# Altium schematic sheet Sheet1.SchDoc
size A
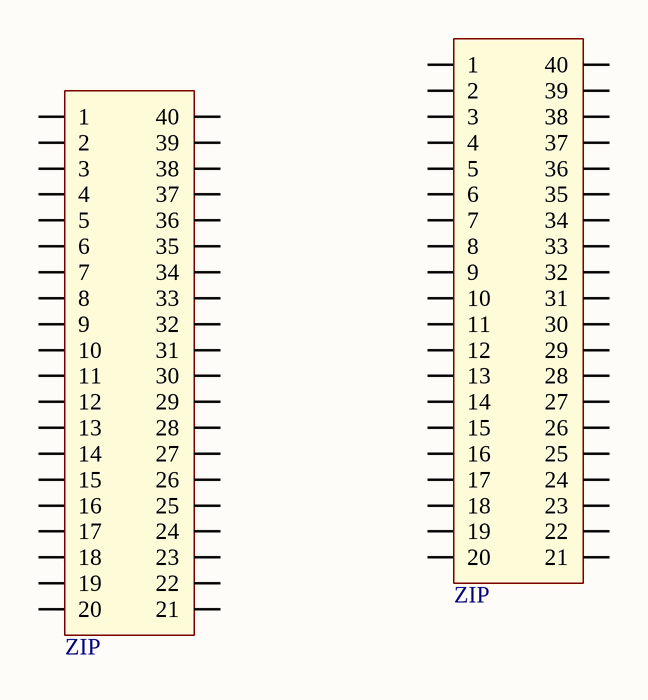
[diagram p0: Sheet1.SchDoc]

## Parts
(Parts that share a designator on the sheet are numbered #1, #2 ... from top to bottom, then left to right.)
ZIP#1  Zip 40  [DIP40/W0.6]  (value not drawn)
ZIP#2  Zip 40  [ZIP40]  (value not drawn)

## Nets

Not connected (* = marked no-connect by the designer): ZIP#1 1 2 3 4 5 6 7 8 9 10 11 12 13 14 15 16 17 18 19 20 21 22 23 24 25 26 27 28 29 30 31 32 33 34 35 36 37 38 39 40; ZIP#2 1 2 3 4 5 6 7 8 9 10 11 12 13 14 15 16 17 18 19 20 21 22 23 24 25 26 27 28 29 30 31 32 33 34 35 36 37 38 39 40

## Library data of the parts
ZIP#1 ZIP#2 = Zip40: De 40 pin; Value: Gat 40 pin